# Altium schematic sheet bop-it_schematic.SchDoc
size 381 x 241 mm; SheetNumber: 1; SheetTotal: 1
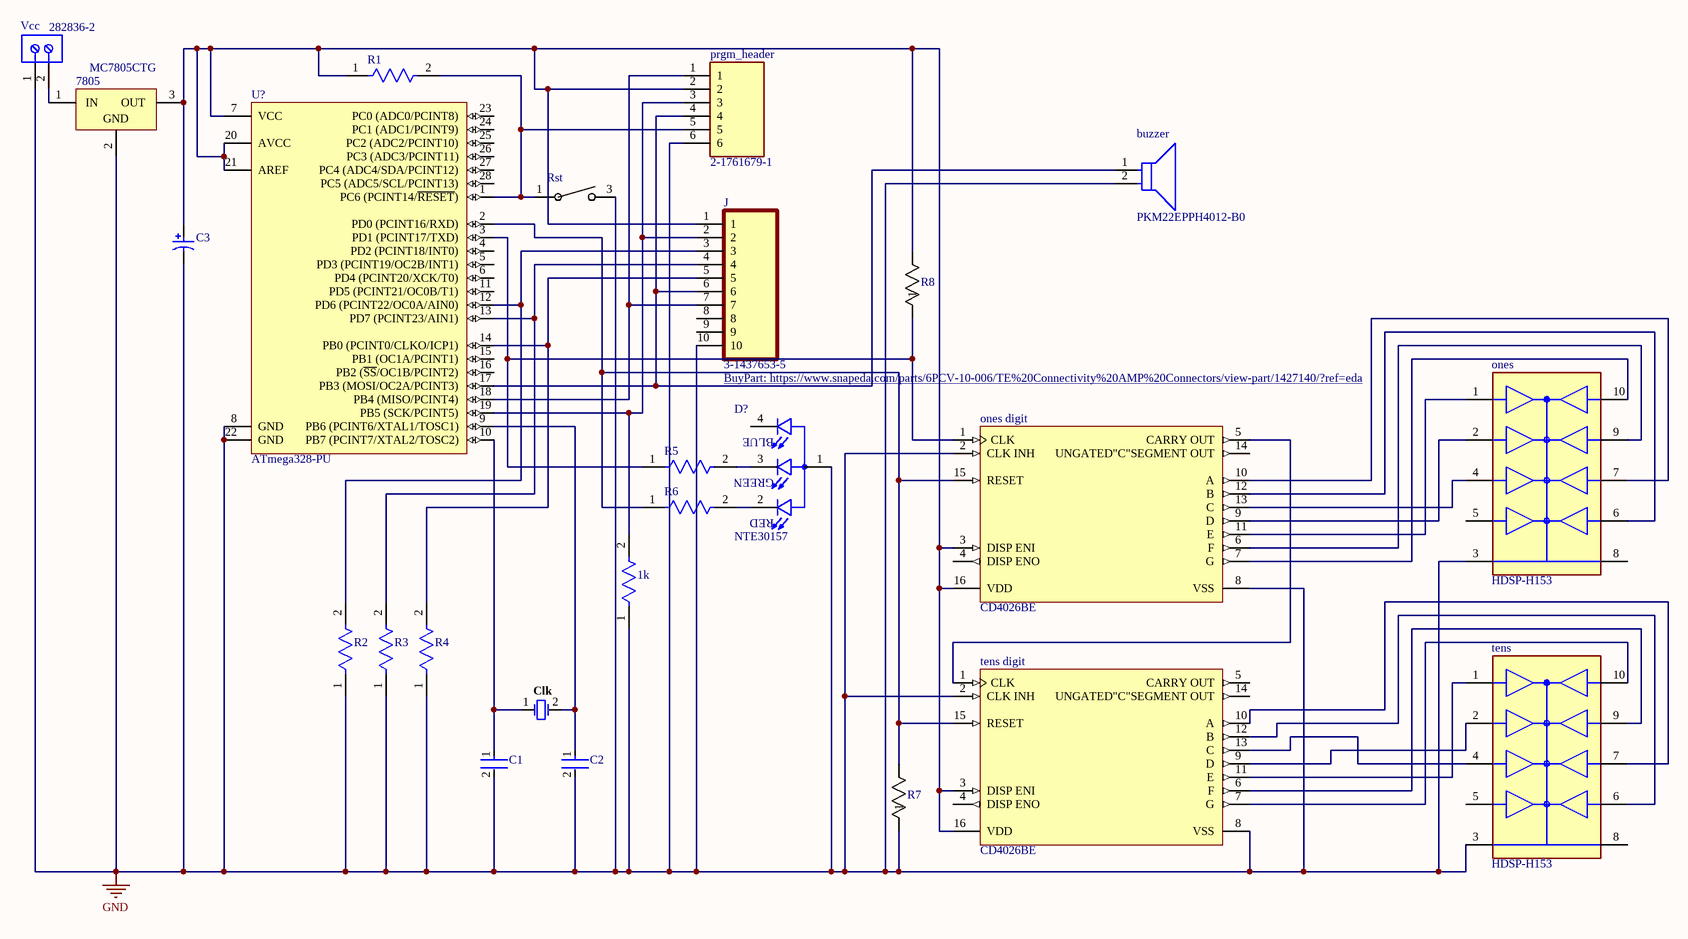
[diagram p0: bop-it_schematic.SchDoc]

## Parts
1k  CF18JT10K0  [FP-CF18-MFG]  (value not drawn)
7805  MC7805CTG  [ONSC-TO-220-3-221AB-01]
buzzer  PKM22EPPH4012-B0  [FP-PKM22EPPH4012-B0-MFG]
C1  RCE5C2A220J0DBH03A  [FP-RCE0DB-MFG]  (value not drawn)
C2  RCE5C2A220J0DBH03A  [FP-RCE0DB-MFG]  (value not drawn)
C3  ECA1HM100  [CAPPR55-200-1100X500X1200]  (value not drawn)
Clk  FOXSLF/160-20  [FOX-FOXSLF160-20]  (value not drawn)
D?  NTE30157  [LED_NTE30157]
J  3-1437653-5  [TE_3-1437653-5]
ones  HDSP-H153  [FP-HDSP-H153-MFG]
ones_digit  CD4026BE  [N0016A]
prgm_header  2-1761679-1  [TE_2-1761679-1]
R1  CF18JT10K0  [FP-CF18-MFG]  (value not drawn)
R2  CF18JT10K0  [FP-CF18-MFG]  (value not drawn)
R3  CF18JT10K0  [FP-CF18-MFG]  (value not drawn)
R4  CF18JT10K0  [FP-CF18-MFG]  (value not drawn)
R5  CF18JT10K0  [FP-CF18-MFG]  (value not drawn)
R6  CF18JT10K0  [FP-CF18-MFG]  (value not drawn)
R7  AC04000001009JAC00  [RES_AC04_VIS]  (value not drawn)
R8  AC04000001009JAC00  [RES_AC04_VIS]  (value not drawn)
Rst  320.03E11BLK  [320.03E11BLK_EWI]  (value not drawn)
tens  HDSP-H153  [FP-HDSP-H153-MFG]
tens_digit  CD4026BE  [N0016A]
U?  ATmega328-PU  [28P3]
Vcc  282836-2  [TECO-282836-2_V]

## Nets
GND: 1k.1 7805.2(GND) buzzer.2 C1.2 C2.2 C3.2 D?.1(A) J.10 ones.3(C) ones_digit.2(CLK_INH) ones_digit.8(VSS) prgm_header.6 R2.1 R3.1 R4.1 R7.1 Rst.3 tens.3(C) tens_digit.2(CLK_INH) tens_digit.8(VSS) U?.8(GND) U?.22(GND) Vcc.1
Net1k_2: 1k.2 J.2 prgm_header.3 U?.19(PB5_(SCK/PCINT5))
Net7805_1: 7805.1(IN) Vcc.2
Net7805_3: 7805.3(OUT) C3.1 J.1 ones_digit.3(DISP_ENI) ones_digit.16(VDD) prgm_header.2 R1.1 R8.2 tens_digit.3(DISP_ENI) tens_digit.16(VDD) U?.7(VCC) U?.20(AVCC) U?.21(AREF)
Netbuzzer_1: buzzer.1 J.6 prgm_header.4 U?.17(PB3_(MOSI/OC2A/PCINT3))
NetC1_1: C1.1 Clk.1 U?.10(PB7_(PCINT7/XTAL2/TOSC2))
NetC2_1: C2.1 Clk.2 U?.9(PB6_(PCINT6/XTAL1/TOSC1))
NetD?_2: D?.2(R_C) R6.2
NetD?_3: D?.3(G_C) R5.2
NetJ_3: J.3 R2.2 U?.12(PD6_(PCINT22/OC0A/AIN0))
NetJ_4: J.4 R3.2 U?.13(PD7_(PCINT23/AIN1))
NetJ_5: J.5 R4.2 U?.14(PB0_(PCINT0/CLKO/ICP1))
NetJ_7: J.7 prgm_header.1 U?.18(PB4_(MISO/PCINT4))
Netones_1: ones.1(ANODE_e) ones_digit.11(E)
Netones_2: ones.2(ANODE_d) ones_digit.9(D)
Netones_4: ones.4(ANODE_c) ones_digit.13(C)
Netones_6: ones.6(ANODE_b) ones_digit.12(B)
Netones_7: ones.7(ANODE_a) ones_digit.10(A)
Netones_9: ones.9(ANODE_f) ones_digit.6(F)
Netones_10: ones.10(ANODE_g) ones_digit.7(G)
Netones_digit_1: ones_digit.1(CLK) R5.1 R8.1 U?.3(PD1_(PCINT17/TXD))
Netones_digit_5: ones_digit.5(CARRY_OUT) tens_digit.1(CLK)
Netones_digit_15: ones_digit.15(RESET) R6.1 R7.2 tens_digit.15(RESET) U?.2(PD0_(PCINT16/RXD))
Netprgm_header_5: prgm_header.5 R1.2 Rst.1 U?.1(PC6_(PCINT14/~{RESET}))
Nettens_1: tens.1(ANODE_e) tens_digit.11(E)
Nettens_2: tens.2(ANODE_d) tens_digit.9(D)
Nettens_4: tens.4(ANODE_c) tens_digit.13(C)
Nettens_6: tens.6(ANODE_b) tens_digit.12(B)
Nettens_7: tens.7(ANODE_a) tens_digit.10(A)
Nettens_9: tens.9(ANODE_f) tens_digit.6(F)
Nettens_10: tens.10(ANODE_g) tens_digit.7(G)

Not connected (* = marked no-connect by the designer): D? 4(B_C); J 8 9; ones 5(ANODE_DP) 8(C); ones_digit 4(DISP_ENO) 14(UNGATED"C"SEGMENT_OUT); tens 5(ANODE_DP) 8(C); tens_digit 4(DISP_ENO) 5(CARRY_OUT) 14(UNGATED"C"SEGMENT_OUT); U? 4(PD2_(PCINT18/INT0)) 5(PD3_(PCINT19/OC2B/INT1)) 6(PD4_(PCINT20/XCK/T0)) 11(PD5_(PCINT21/OC0B/T1)) 15(PB1_(OC1A/PCINT1)) 16(PB2_(~{SS}/OC1B/PCINT2)) 23(PC0_(ADC0/PCINT8)) 24(PC1_(ADC1/PCINT9)) 25(PC2_(ADC2/PCINT10)) 26(PC3_(ADC3/PCINT11)) 27(PC4_(ADC4/SDA/PCINT12)) 28(PC5_(ADC5/SCL/PCINT13))

## Notes on the sheet
- (in symbol NTE30157) BLUE; GREEN; RED

## Library data of the parts
1k R1-R6 = CMP-26528-000002-1: RES 10K OHM 1/8W 5% CF AXIAL; Manufacturer: Stackpole Electronics; Power Rating: 0.125W; Temperature Coefficient: 0-500ppm/°C; Resistance: 10kΩ; Voltage Rating: 250V; Description: RES 10K OHM 1/8W 5% AXIAL; Value: 10kΩ; Temperature: -55°C to +155°C; Height: 2mm; Lead Free: Yes; Automotive: No; Device Class L2: Resistors; Package: CF18; Series: CF; ComponentLink2Description: Datasheet; Ipc Land Pattern Name: RESAD656W65L360D200; Manufacturer Part Number: CF18JT10K0; Temperature Range High: +155°C; RoHS: TRUE; Device Class L3: Through-Hole Resistors; Temperature Range Low: -55°C; Device Class L1: Passive Components; Category: Res; Octopart: https://octopart.com/cf18jt10k0-stackpole+electronics-19205642; Composition: Carbon Film; Digikey Description: RES 10K OHM 1/8W 5% CF AXIAL; ComponentLink2URL: http://www.seielect.com/Catalog/SEI-CF_CFM.pdf; Tolerance: 5%
7805 = CMP-2000-04928-1: Positive Voltage Regulator, 1 A, 5 V, 0 to 125 degC, 3-Pin TO-220, RoHS, Tube; Manufacturer: ON Semiconductor; Resistance, Thermal, Junction to Case: 5degC/W; Voltage, Supply: 35V; Regulator Function: Standard; Temperature, Operating, Maximum: +125degC; Load Regulation: 25mV; Regulator Type: PositiveVoltageOut; Current, Output, Maximum: 1A; Regulation, Load: 1.3mV; Number of Outputs: 1; Temperature, Operating, Range: 0to+125degC; Regulation, Line: 0.5mV; Line Regulation: 20mV; Voltage, Input Range: Maximumof35V; Output Type: Fixed; Current, Quiescent Supply: 6.5mA; Dropout Voltage: 2V; Temperature, Operating, Minimum: 0degC; Package Version: Rev. A, 11/2010; Current, Supply: 3.2mA; Voltage, Output: 5V; Voltage, Noise: 10μV/V; Package Type: TO-220; Voltage, Input, High Level: 35V; Datasheet URL: http://www.onsemi.com/pub_link/Collateral/MC7800-D.PDF; Dimensions: 10.28x4.82x15.75mm; Width: 4.82mm; Type: VoltageRegulator; Mounting Type: ThroughHole; Polarity: Positive; Datasheet Version: Rev. 27, 11/2014; Height: 15.75mm; Dropout Voltage Measurement Current: 1A; Package Description: 3-Pin Flange Mount, Vertical Straight Lead, Body 9.97 x 4.445 mm, Pitch 2.54 mm; Manufacturer URL: http://www.onsemi.com/; Voltage, Dropout: 2V; Length: 10.28mm; Number of Pins: 3; Package Reference: TO-220-3-221AB-01
buzzer = CMP-06203-000002-2: AUDIO PIEZO TRANSDUCER 30V TH; Voltage Rating: 1.5V; Washable: No; Self Resonant Frequency: 4kHz; Series: PK; Mount: Through Hole; Packaging: Bulk; Termination: PC Pins; Radiation Hardening: No; Frequency: 4kHz; Min Operating Temperature: -20°C; Height: 12.5mm; Height - Seated (Max): 0.492inch; Package Quantity: 750; Contact Plating: Tin; Max Operating Temperature: 70°C; Diameter: 22mm
C1 C2 = CMP-06035-047347-1: Cap Ceramic 22pF 100V C0G ±5% Radial 2.5mm +125°C Ammo Pack; Lead Diameter: 0.5mm; Lead/Base Style: Straight; Height: 3.5mm; Voltage: 100V; Mount: Through Hole; Min Operating Temperature: -55°C; Height - Seated (Max): 0.138inch; Dielectric: C0G; Width: 0.098inch; Depth: 2.5mm; Lead Pitch: 0.098inch; Packaging: Tape and Reel; Voltage Rating (DC): 100V; Capacitance: 22pF; Package Quantity: 2000; Max Operating Temperature: 125°C; Tolerance: 5%; Termination: Radial; Voltage Rating: 100V; Case/Package: Radial; Resistor Type: Ceramic; Length: 3.6mm; Ratings: AEC-Q200
C3 = CMP-1665-00038-2: Aluminum Electrolytic Capacitor, 10 uF, +/- 20%, 50 V, -40 to 85 degC, 2-Pin THD, RoHS, Bulk; Manufacturer: Panasonic; Life (Hours): 2000Hour; Lead/Base Style: Straight; Dissipation Factor: 0.12%; Capacitance: 10uF; Leakage Current: 3uA; Dielectric Material: Aluminium; Lead Diameter: 0.5mm; Voltage Rating: 50V; Ripple Current: 65mA; Package Reference: CAPPR55-200-1100X500X1200; Height: 11mm; Diameter: 5mm; REACH SVHC: NoSVHC; Mount: ThroughHole; Packaging: Bulk; Manufacturer URL: http://www.panasonic.com/; Termination: Radial; Datasheet URL: https://industrial.panasonic.com/cdbs/www-data/pdf/RDF0000/ABA0000C1218.pdf; Lead Free: LeadFree; Height - Seated (Max): 0.472inch; Case/Package: Radial; Package Description: 2-Pin Radial Lead, Dia 5 mm, Height 12 mm; Tolerance: 20%; Datasheet Version: Rev. 05, 10/2016; Package Quantity: 200; Ripple Current (AC): 65mA; Min Operating Temperature: -40degC; RoHSCompliant: true; Number of Pins: 2; Max Operating Temperature: 85degC; Voltage: 50V; Lead Pitch: 2mm; Radiation Hardening: No; Voltage Rating (DC): 50V; Length: 11mm
Clk = CMP-1749-00003-1: Resistance Weld Thru-Hole Crystal, 16 MHz, -20 to 70 degC, 2-Pin THD, RoHS, Bulk; Voltage Rating: 250 V; Tolerance: 1%; Resistance: 221 kohm; Case\Package: Axial; Power Rating: 250 mW; RoHSCompliant: true; Package Quantity: 200; Packaging: Bulk; Min Operating Temperature: -55 degC; DatasheetVersion: Mar-15; ComponentLink1URL: http://www.foxonline.com/; Max Operating Temperature: 155 degC; PackageReference: FOXSLF160-20; Mount: Through Hole; PackageDescription: 2-Pin Through Hole Device, Body 11.35 x 4.65 mm; ComponentLink1Description: Manufacturer URL; ComponentLink2URL: http://www.foxonline.com/pdfs/hc49slf.pdf; ComponentLink2Description: Datasheet; Length: 0.248 inch
D? = NTE30157: LED 10MM RGB COMMON ANODE; MF: NTE Electronics, Inc; Value: *; SnapEDA_Link: https://www.snapeda.com/parts/NTE30157/NTE%20Electronics/view-part/5532260/?ref=snap; MP: NTE30157; Check_prices: https://www.snapeda.com/parts/NTE30157/NTE%20Electronics/view-part/5532260/?ref=eda; Purchase-URL: https://pricing.snapeda.com/search/part/NTE30157/?ref=eda; Availability: Warning; Price: None; Package: None
J = 3-1437653-5: Conn; Term Strip; Tri-Barrier; Raised; 10; 9.53 mm; Single Row; Open Bottom; MP: 6PCV-10-006; MF: TE Connectivity; DigiKey-Purchase-URL: https://snapeda.com/shop?store=DigiKey&id=1427140; Value: *; Package: None; Availability: Good; Price: None; SnapEDA_Link: https://www.snapeda.com/parts/6PCV-10-006/TE%20Connectivity%20AMP%20Connectors/view-part/1427140/?ref=snap; Mouser-Purchase-URL: https://snapeda.com/shop?store=Mouser&id=1427140; Arrow_Electronics-Purchase-URL: https://snapeda.com/shop?store=Arrow+Electronics&id=1427140; BuyPart: https://www.snapeda.com/parts/6PCV-10-006/TE%20Connectivity%20AMP%20Connectors/view-part/1427140/?ref=eda
ones tens = CMP-18395-000002-1: LED 7-SEG 14.2MM CC RED RHD RHD; Manufacturer: Broadcom; Wavelength: 637nm; Power Dissipation: 96mW; Standoff Height: 1.14mm; Luminous Intensity: 16mcd; Test Current: 100mA; Element Config: Common Cathode; Reverse Voltage: 15V; Viewing Angle: 100°; Forward Voltage: 2V; Device Class L2: Displays; Temperature Range High: +100°C; ComponentLink2Description: Datasheet; Device Class L3: LED Displays; Automotive: No; Digikey Description: LED 7-SEG 14.2MM CC RED RHD RHD; Display Type: LED; Lead Free: Yes; Category: Disp; Package: HDSP-H153; Height: 8mm; Octopart: https://octopart.com/hdsp-h153-broadcom-71129578; RoHS: TRUE; Device Class L1: Optoelectronics; Manufacturer Part Number: HDSP-H153; Temperature: -20°C to +100°C; ComponentLink2URL: https://docs.broadcom.com/docs/AV02-1107EN; Forward Current: 100mA; Temperature Range Low: -20°C
ones_digit tens_digit = CMP-1623-00561-2: CMOS Decade Counter/Divider with Decoded 7-Segment Display Outputs and Display Enable, N0016A, TUBE; Manufacturer: Texas Instruments; ICC @ Nom Voltage(Max)(mA): 0.03; tpd @ Nom Voltage(Max)(ns): 250; F @ Nom Voltage(Max)(Mhz): 8; Bits(#): 7; VCC(Max)(V): 18; VCC(Min)(V): 3; Output Drive (IOL/IOH)(Max)(mA): 1.5/-1.5; Inputs: 1; Rating: Catalog; Technology Family: CD4000; Schmitt Trigger: No; Voltage(Nom)(V): 5,10,15; DatasheetVersion: SCHS031B; Operating Temperature Range(C): -55 to 125; Code_JEDEC: MS-001; Input Type: CMOS; Output Type: CMOS; Type: Decade; Generic Part Number: CD4026B; PackageReference: N0016A; Function: Counter
prgm_header = 2-1761679-1: IDC LOW PRO HDR 6P VERT BLUE; Product_Type: Connector; Centerline_Pitch: 2.54 mm[.1 in]; Number_of_Positions: 6; MF: TE Connectivity; Availability: Unavailable; Package: None; EU_RoHS_Compliance: Compliant; SnapEDA_Link: https://www.snapeda.com/parts/2-1761679-1/TE%20Connectivity%20AMP%20Connectors/view-part/1406669/?ref=snap; MP: 2-1761679-1; Price: None; TE_purchase_URL: https://www.te.com/usa-en/product-2-1761679-1.html?te_bu=Cor&te_type=disp&te_campaign=seda_glo_cor-seda-global-disp-prtnr-fy19-seda-model-bom-cta_sma-317_1&elqCampaignId=32493; Value: *
R7 R8 = CMP-00030-43026512-1: AC04000001009JAC00 AC04 Series Axial Wirewound Resistor 10Ohms +/-5% 4W -80 - -10ppm/degC; Temperature Coefficient: -10ppm/°C; Tolerance: 5%; Resistance: 10Ω; Contact Plating: Tin; Max Operating Temperature: 200°C; Diameter: 5.5mm; Features: Flame Retardant Coating; Width: 5.51mm; Max Power Dissipation: 4W; REACH SVHC: No SVHC; Length: 16.5mm; RoHS: Compliant; Power Rating: 4W; Case/Package: Axial; Thickness: 5.51mm; Min Operating Temperature: -40°C; Composition: Wirewound; Schedule B: 8533210080, 8533210080; Mount: Through Hole; Packaging: Tape & Box (TB); Radiation Hardening: No; Number of Terminations: 2; Military Standard: Not; Termination: Axial; NexarPartId: 43026512
Rst = 320.03E11BLK: No Description Available; Mfr_Name: E-Switch; Digi-Key_Part_Number_1: EG4366-ND
U? = CMP-0095-00015-2: 8-bit AVR Microcontroller, 32KB Flash, 1KB EEPROM, 2KB SRAM, 28-pin PDIP, Industrial Grade (-40°C to 85°C); ComponentLink3Description: ATmega48A/48PA/88A/88PA/168A/168PA/328/328P Summary; RevisionNote: DatasheetVersion updated. URLs added.; DatasheetVersion: revD, May-2011; ComponentLink1URL: http://www.atmel.com/; PackageVersion: revB, Sep-2001; PackageDescription: 28-lead (0.300"/7.62mm Wide) Plastic Dual Inline Package (PDIP); PackageReference: 28P3; ComponentLink1Description: Manufacturer URL; ComponentLink2Description: ATmega48A/48PA/88A/88PA/168A/168PA/328/328P Datasheet; ComponentLink3URL: http://www.atmel.com/dyn/resources/prod_documents/8271S.pdf; ComponentLink2URL: http://www.atmel.com/dyn/resources/prod_documents/8271.pdf
Vcc = CMP-1684-00017-1: Female Header, Pitch 5 mm, 1 x 2 Position, Height 10 mm, Tail Length 3.5 mm, Rohs, Bulk; Manufacturer: TE Connectivity; Wire Gauge: 16-30AWG; Product Training Modules: Wire-to-BoardEurostyleTerminalBlocks; Clamp Material - Plating: Brass-NickelPlated; Voltage: 300V; Mating Orientation: HorizontalwithBoard; Current: 13.5A; Pitch: 0.197"(5.00mm); Screw Thread: M3; 3D Model: 282836-2.pdf; Other Names: 5ULV-02B / A98076; Dynamic Catalog: BuchananSeries; Number of Levels: 1; Torque - Screw: 0.68Nm(6Lb-In); Featured Product: EurostyleTerminalBlockConnectors; Positions Per Level: 2; Wire Termination: Screw-RisingCageClamp; Datasheet URL: http://www.te.com.cn/commerce/DocumentDelivery/DDEController?Action=showdoc&DocId=Catalog+Section%7F1308389_EUROSTYLE_TERMINAL_BLOCKS%7F0607%7Fpdf%7FEnglish%7FENG_CS_1308389_EUROSTYLE_TERMINAL_BLOCKS_0607.pdf%7F282836-2; Color: Green; Family: TerminalBlocks-WiretoBoard; RoHS Information: 282836-2StatementofCompliance; Standard Package: 300; Contact Material - Plating: Brass-TinPlated; Manufacturer URL: http://www.te.com; Housing Material: Polyamide(PA66),Nylon6/6; Features: Interlocking(Side); Package Description: Female Header, Pitch 5 mm, 1 x 2 Position, Height 10 mm, Tail Length 3.5 mm; Mounting Type: ThroughHole; Package Reference: THD; Packaging: Bulk; Series: Buchanan; Category: Connectors,Interconnects; Screw Material - Plating: Brass-NickelPlated